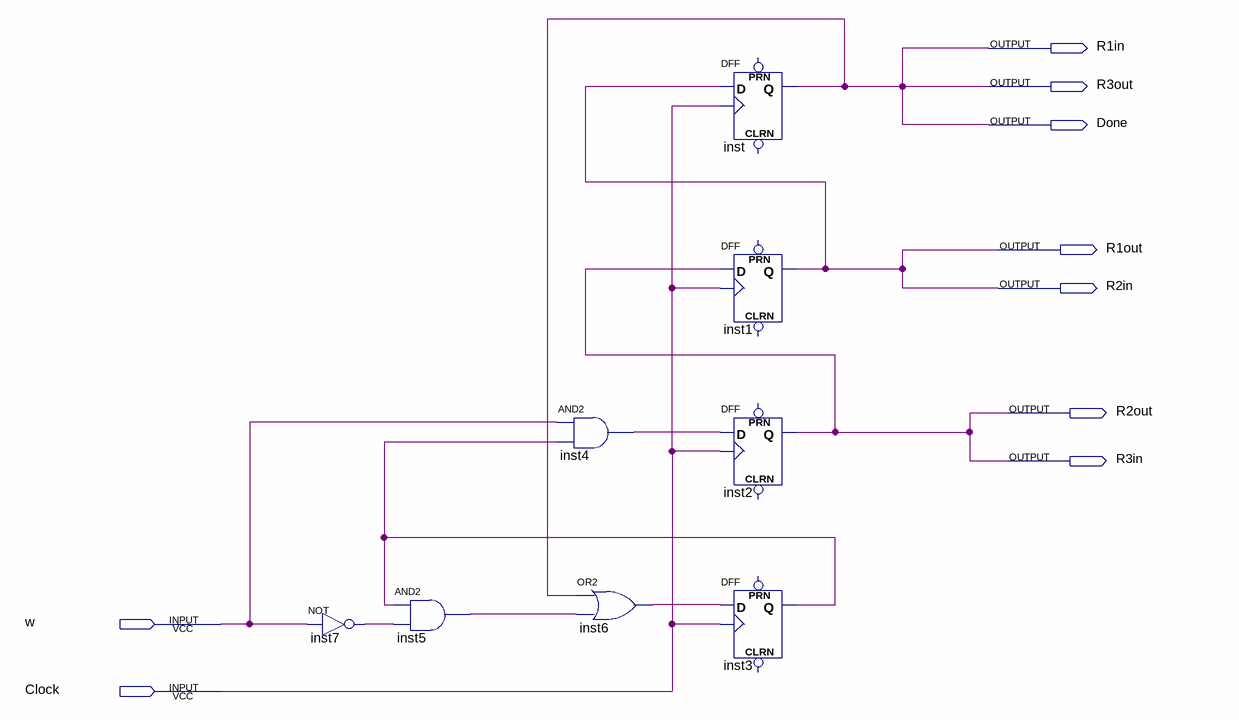
[diagram p0: schematic sheet]
// Quartus schematic Control_circuit.bdf as structural Verilog: 8 symbols, 9 pins
module Control_circuit (
  input  w,
  input  Clock,
  output R1in,
  output R3out,
  output Done,
  output R1out,
  output R2in,
  output R2out,
  output R3in
);

  wire inst3_q, inst4_out, inst5_out, inst6_out, inst7_out;

  not inst7 (inst7_out, w);
  and inst5 (inst5_out, inst3_q, inst7_out);
  and inst4 (inst4_out, w, inst3_q);
  or inst6 (inst6_out, Done, inst5_out);
  DFF inst (.CLK(Clock), .D(R1out), .Q(Done));  // open: CLRN, PRN
  DFF inst1 (.CLK(Clock), .D(R2out), .Q(R1out));  // open: CLRN, PRN
  DFF inst2 (.CLK(Clock), .D(inst4_out), .Q(R2out));  // open: CLRN, PRN
  DFF inst3 (.CLK(Clock), .D(inst6_out), .Q(inst3_q));  // open: CLRN, PRN

  assign R1in = Done;
  assign R2in = R1out;
  assign R3in = R2out;
  assign R3out = Done;
endmodule
